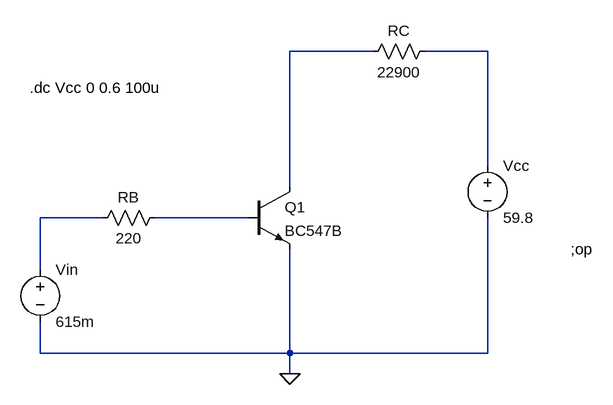
[diagram p0: schematic BJT-schematics.asc]
BJT-schematics.asc, the LTspice schematic file:
Version 4
SHEET 1 920 680
WIRE 576 -224 448 -224
WIRE 752 -224 656 -224
WIRE 752 -48 752 -224
WIRE 448 -16 448 -224
WIRE 160 32 64 32
WIRE 384 32 240 32
WIRE 64 112 64 32
WIRE 64 240 64 192
WIRE 448 240 448 80
WIRE 448 240 64 240
WIRE 752 240 752 32
WIRE 752 240 448 240
WIRE 448 272 448 240
FLAG 448 272 0
SYMBOL voltage 64 96 R0
WINDOW 123 0 0 Left 0
WINDOW 39 0 0 Left 0
SYMATTR InstName Vin
SYMATTR Value 615m
SYMBOL npn 384 -16 R0
SYMATTR InstName Q1
SYMATTR Value BC547B
SYMBOL voltage 752 -64 R0
WINDOW 123 0 0 Left 0
WINDOW 39 0 0 Left 0
SYMATTR InstName Vcc
SYMATTR Value 59.8
SYMBOL res 256 16 R90
WINDOW 0 0 56 VBottom 2
WINDOW 3 32 56 VTop 2
SYMATTR InstName RB
SYMATTR Value 220
SYMBOL res 672 -240 R90
WINDOW 0 0 56 VBottom 2
WINDOW 3 32 56 VTop 2
SYMATTR InstName RC
SYMATTR Value 22900
TEXT 880 80 Left 2 !;op
TEXT 48 -168 Left 2 !.dc Vcc 0 0.6 100u

The netlist it stands for:
* BJT-schematics.asc
Vin N003 0 615m
Q1 N001 N004 0 0 BC547B
Vcc N002 0 59.8
RB N004 N003 220
RC N002 N001 22900
.model NPN NPN
.model PNP PNP
.lib standard.bjt
;op
.dc Vcc 0 0.6 100u
.backanno
.end